# Altium schematic sheet Sintetizador2.SchDoc
size A4; SheetNumber: 12; SheetTotal: 13
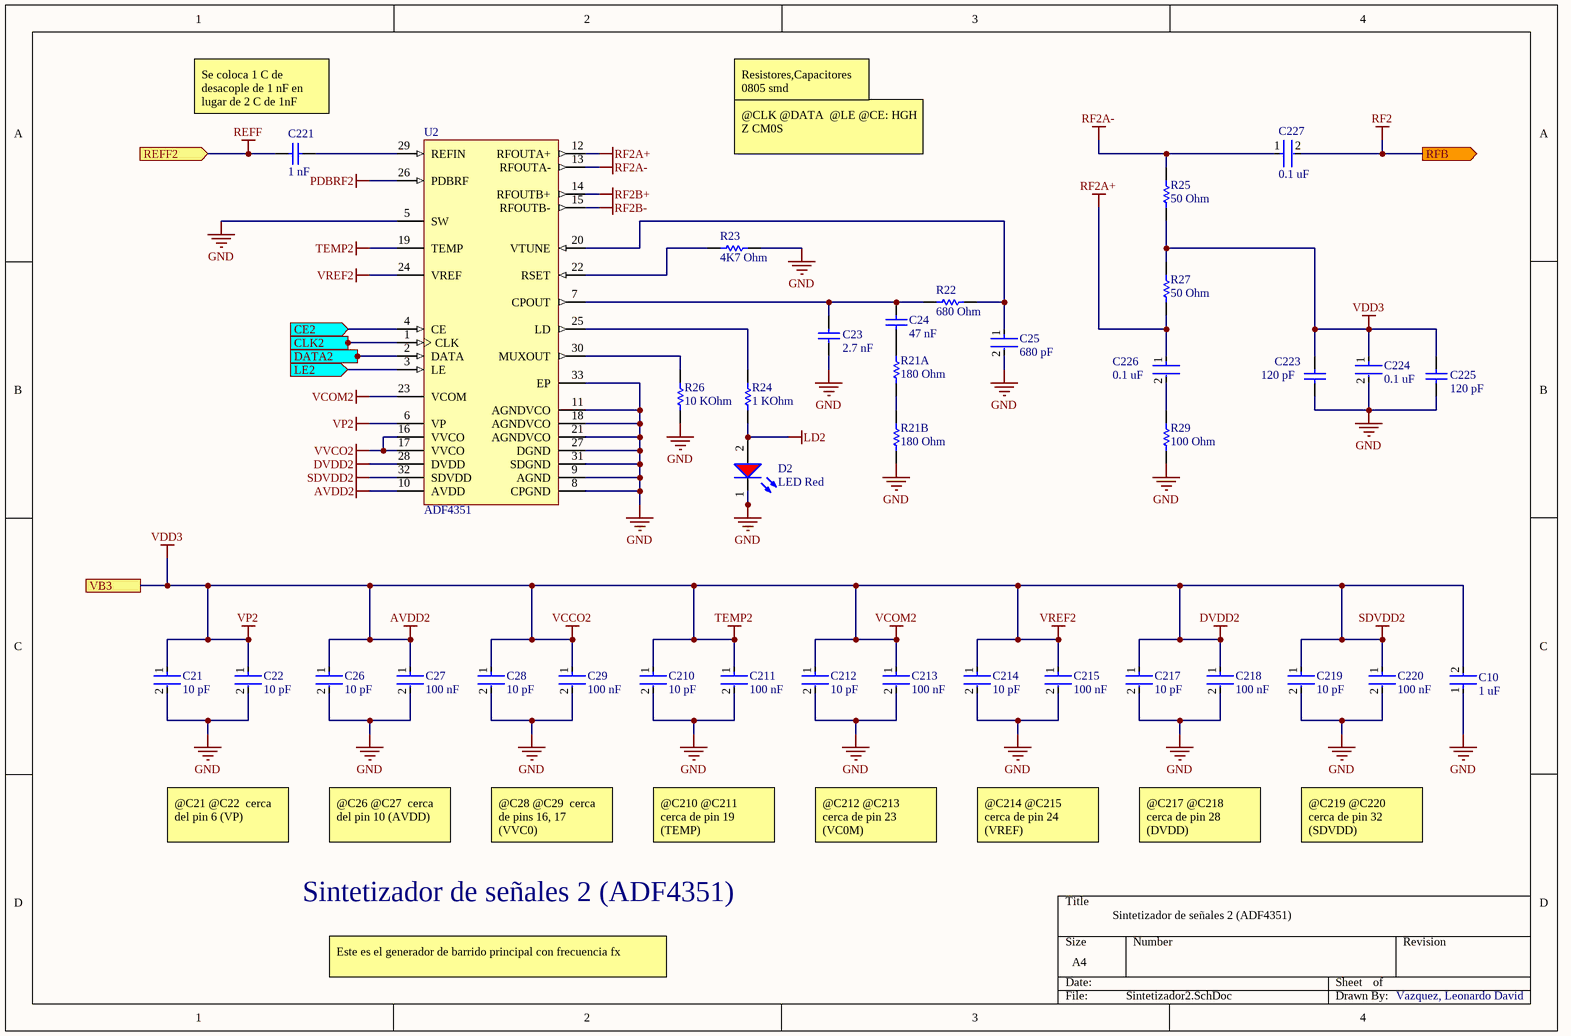
[diagram p0: Sintetizador2.SchDoc]

## Parts
C10  1 uF  [FP-CC0805-0_85-MFG]
C21  10 pF  [FP-CL21-IPC_C]
C22  10 pF  [FP-CL21-IPC_C]
C23  2.7 nF  [CAPC2013X130X50NL20T20]
C24  47 nF  [CAPC2013X100X50ML20T25]
C25  680 pF  [FP-C0805C-DN-MFG]
C26  10 pF  [FP-CL21-IPC_C]
C27  100 nF  [FP-CL21-IPC_C]
C28  10 pF  [FP-CL21-IPC_C]
C29  100 nF  [FP-CL21-IPC_C]
C210  10 pF  [FP-CL21-IPC_C]
C211  100 nF  [FP-CL21-IPC_C]
C212  10 pF  [FP-CL21-IPC_C]
C213  100 nF  [FP-CL21-IPC_C]
C214  10 pF  [FP-CL21-IPC_C]
C215  100 nF  [FP-CL21-IPC_C]
C217  10 pF  [FP-CL21-IPC_C]
C218  100 nF  [FP-CL21-IPC_C]
C219  10 pF  [FP-CL21-IPC_C]
C220  100 nF  [FP-CL21-IPC_C]
C221  1 nF  [CAPC2013X94X50NL20T25]
C223  120 pF  [FP-CC0805-0_85-MFG]
C224  0.1 uF  [FP-CC0805-0_85-MFG]
C225  120 pF  [FP-CC0805-0_85-MFG]
C226  0.1 uF  [FP-CC0805-0_85-MFG]
C227  0.1 uF  [FP-CC0805-0_85-MFG]
D2  LED Red  [WL-SMCW_0805_150080xx75000]
R21A  180 Ohm  [RESC2013X70X40ML20T20]
R21B  180 Ohm  [RESC2013X70X40ML20T20]
R22  680 Ohm  [RESC2013X70X40ML20T20]
R23  4K7 Ohm  [RESC2013X70X40ML20T20]
R24  1 KOhm  [RESC2013X60X40ML20T25]
R25  50 Ohm  [RESC2013X60X40ML20T25]
R26  10 KOhm  [RESC2013X60X40ML20T25]
R27  50 Ohm  [RESC2013X60X40ML20T25]
R29  100 Ohm  [RESC2013X60X40ML20T25]
U2  ADF4351  [ADI-CP-32-2_L]

## Ports
CE2 (in, see ADF4351_10X2_v1[3C], Data_converter[4A]), CLK2 (in, see ADF4351_10X2_v1[3C], Data_converter[4B]), DATA2 (in, see ADF4351_10X2_v1[3C], Data_converter[4B]), LE2 (in, see ADF4351_10X2_v1[3C], Data_converter[4C]), REFF2 (in, see ADF4351_10X2_v1[3B]), RFB (out, see ADF4351_10X2_v1[3B]), VB3 (see ADF4351_10X2_v1[3B])

## Nets
AVDD2: C10.2 C21.1 C22.1 C26.1 C27.1 C28.1 C29.1 C210.1 C211.1 C212.1 C213.1 C214.1 C215.1 C217.1 C218.1 C219.1 C220.1 C223.1 C224.1 C225.1 R25.2 R27.1 U2.6(VP) U2.10(AVDD) U2.19(TEMP) U2.23(VCOM) U2.24(VREF) U2.28(DVDD) U2.32(SDVDD) ; port VB3  [also labelled DVDD2, SDVDD2, TEMP2, VCCO2, VCOM2, VDD3, VP2, VREF2]
GND: C10.1 C21.2 C22.2 C23.1 C25.2 C26.2 C27.2 C28.2 C29.2 C210.2 C211.2 C212.2 C213.2 C214.2 C215.2 C217.2 C218.2 C219.2 C220.2 C223.2 C224.2 C225.2 D2.1(K) R21B.1 R23.2 R26.2 R29.2 U2.5(SW) U2.8(CPGND) U2.9(AGND) U2.11(AGNDVCO) U2.18(AGNDVCO) U2.21(AGNDVCO) U2.27(DGND) U2.31(SDGND) U2.33(EP)
LD2: D2.2(A) R24.1
PDBRF2: U2.26(PDBRF)
REFF: C221.1 ; port REFF2
RF2: C227.2 ; port RFB
RF2A+: C226.1 R27.2 U2.12(RFOUTA+)
RF2A-: C227.1 R25.1 U2.13(RFOUTA-)
RF2B+: U2.14(RFOUTB+)
RF2B-: U2.15(RFOUTB-)
VVCO2: U2.16(VVCO) U2.17(VVCO)
CE2: U2.4(CE) ; port CE2
CLK2: U2.1(CLK) ; port CLK2
DATA2: U2.2(DATA) ; port DATA2
LE2: U2.3(LE) ; port LE2
NetC23_2: C23.2 C24.2 R22.1 U2.7(CPOUT)
NetC24_1: C24.1 R21A.2
NetC25_1: C25.1 R22.2 U2.20(VTUNE)
NetC221_2: C221.2 U2.29(REFIN)
NetC226_2: C226.2 R29.1
NetR21A_2: R21A.2 R21B.1
NetR23_1: R23.1 U2.22(RSET)
NetR24_2: R24.2 U2.25(LD)
NetR26_1: R26.1 U2.30(MUXOUT)

## Notes on the sheet
- (near C221) Se coloca 1 C de desacople de 1 nF en lugar de 2 C de 1nF
- Resistores,Capacitores 0805 smd
  2N3904 SOT-23
- @CLK @DATA  @LE @CE: HGH Z CM0S
- @C21 @C22  cerca del pin 6 (VP)
- @C26 @C27  cerca del pin 10 (AVDD)
- @C28 @C29  cerca de pins 16, 17 (VVC0)
- @C210 @C211  cerca de pin 19 (TEMP)
- @C212 @C213  cerca de pin 23 (VC0M)
- @C214 @C215  cerca de pin 24 (VREF)
- @C217 @C218  cerca de pin 28 (DVDD)
- @C219 @C220  cerca de pin 32 (SDVDD)
- Sintetizador de señales 2 (ADF4351)
- Este es el generador de barrido principal con frecuencia fx
- Vazquez, Leonardo David

## Library data of the parts
C10 C22 C224 C226 C227 = CMP-2100-03606-3: CAP CER 0.1UF 50V X7R 0805; Manufacturer Part Number: CC0805KRX7R9BB104; Manufacturer: Yageo; Tolerance: 0.1; Capacitance: 100 nF; Value: 100 nF; Material: Ceramic; Device Class L1: Passive Components; ComponentLink2Description: Datasheet; Package: CC0805-0.85; Digikey Description: CAP CER 0.1UF 50V X7R 0805; Device Class L3: Ceramic Capacitors; Temperature: -30°C to +85°C; Temperature Characteristic: X7R; Voltage Rating: 50 V; Height: 0.95mm; RoHS: TRUE; Ipc Land Pattern Name: CAPC200125X85; Device Class L2: Capacitors; Category: Cap; Temperature Range Low: -30°C; Temperature Range High: +85°C; Mouser Description: Multilayer Ceramic Capacitors MLCC - SMD/SMT 100nF 50V X7R 10%; Footprint Url: http://www.yageo.com/exep/pages/download/literatures/UPY-C_GEN_24.pdf; Automotive: No; Octopart: https://octopart.com/cc0805krx7r9bb104-yageo-192993; Lead Free: Yes; ComponentLink2URL: http://www.yageo.com/documents/recent/UPY-GPHC_Y5V_6.3V-to-50V_8.pdf
C21 C26 C28 C210 C212 C214 C217 C219 = CMP-13271-003234-1: CL21 Series 0805 10pF 100V ±0.25pF Tolerance C0G Multilayer Ceramic Chip Capacitor; Temperature Coefficient: 300ppm/°C; Length: 2mm; Packaging: Tape and Reel; Width: 0.049inch; Thickness: 0.03inch; Depth: 1.25mm; Case Code (Imperial): 0805; Package Quantity: 1; Capacitance: 10pF; Voltage: 100V; Case Code (Metric): 2012; Dielectric: C0G; Voltage Rating: 100V; Case/Package: 0805; Height: 0.65mm; Mount: Surface Mount; Radiation Hardening: No; Max Operating Temperature: 125°C; Voltage Rating (DC): 100V; Min Operating Temperature: -55°C; Material: Ceramic
C23 = CMP-2007-03635-1: Part Number: CDR31BX272BKMSAJ; Manufacturer: Vitramon
C24 = CMP-2007-03713-1: Manufacturer: Kemet; Part Number: C0805F473K5RACTU
C25 = CMP-1036-02839-3: CAP CER 680PF 100V 5% NP0 0805; Manufacturer: KEMET; Manufacturer Part Number: C0805C681J1GACTU; Temperature Coefficient: 30ppm/°C; Temperature Characteristic: C0G; Material: Ceramic; Tolerance: 0.05; Voltage Rating: 100 V; Category: Cap; Package: C0805C-DN; Ipc Land Pattern Name: CAPC200125X78; Automotive: No; Device Class L3: Ceramic Capacitors; Digikey Description: CAP CER 680PF 100V 5% NP0 0805; ComponentLink2Description: Datasheet; Lead Free: Yes; Temperature: -55°C to +125°C; Device Class L2: Capacitors; Value: 680 pF; ComponentLink2URL: https://content.kemet.com/datasheets/KEM_C1003_C0G_SMD.pdf; Device Class L1: Passive Components; Mouser Description: Cap Ceramic 680pF 100V C0G 5% SMD 0805 125°C Plastic T/R; Octopart: https://octopart.com/c0805c681j1gactu-kemet-8375796; Temperature Range High: +125°C; RoHS: TRUE; Height: 0.88mm; Temperature Range Low: -55°C; Capacitance: 680 pF
C27 C29 C211 C213 C215 C218 C220 = CMP-2100-03606-3: CAP CER 0.1UF 50V X7R 0805; Manufacturer Part Number: CC0805KRX7R9BB104; Manufacturer: Yageo; Tolerance: 0.1; Material: Ceramic; Device Class L1: Passive Components; ComponentLink2Description: Datasheet; Package: CC0805-0.85; Digikey Description: CAP CER 0.1UF 50V X7R 0805; Capacitance: 100 nF; Device Class L3: Ceramic Capacitors; Value: 100 nF; Temperature: -30°C to +85°C; Temperature Characteristic: X7R; Voltage Rating: 50 V; Height: 0.95mm; RoHS: TRUE; Ipc Land Pattern Name: CAPC200125X85; Device Class L2: Capacitors; Category: Cap; Temperature Range Low: -30°C; Temperature Range High: +85°C; Mouser Description: Multilayer Ceramic Capacitors MLCC - SMD/SMT 100nF 50V X7R 10%; Footprint Url: http://www.yageo.com/exep/pages/download/literatures/UPY-C_GEN_24.pdf; Automotive: No; Octopart: https://octopart.com/cc0805krx7r9bb104-yageo-192993; Lead Free: Yes; ComponentLink2URL: http://www.yageo.com/documents/recent/UPY-GPHC_Y5V_6.3V-to-50V_8.pdf
C221 = CMP-2007-04125-1: Manufacturer: AVX Interconnect / Elco; Part Number: 08051A102J4T2A
C223 C225 = CMP-2007-00459-1: Manufacturer: Kemet; Part Number: C0805C101JCGACTU
D2 = CMP-1426-00011-2: NexarPartId: 29717781; Peak Wavelength: 630nm; Wavelength: 625nm; Viewing Angle: 140°; Test Current: 20mA; Forward Voltage: 2V; Forward Current: 100mA; Lens Style: Clear, Rectangular; Luminous Intensity: 150mcd; Max Reverse Voltage (DC): 5V; Length: 2mm; Case Code (Imperial): 0805; RoHS: Compliant; Max Operating Temperature: 85°C; Height: 700µm; Packaging: Tape and Reel; Color: Red; Case/Package: 0805; REACH SVHC: Unknown; Dominant Wavelength: 625nm; Min Operating Temperature: -40°C; Case Code (Metric): 2012; Mount: Surface Mount; Width: 1.25mm
R21A R21B = CMP-2001-00537-1: Manufacturer: Panasonic; Part Number: ERJ-6ENF3600V
R22 R23 = CMP-2001-00569-1: Part Number: ERJ6ENF6803V; Manufacturer: Panasonic
R24-R27 R29 = CMP-2001-00580-1: Manufacturer: Panasonic; Part Number: ERA6AEB101V
U2 = CMP-0287-00015-1: Wideband Synthesizer with Integrated VCO, CP-32-2, Pb-Free, 1500 Reel; Max RF Input (MHz): 4.4GHz; RF Prescalers: 4/5,8/9; Max REFin (MHz): 250MHz; Frequency Range: 35MHz-4.4GHz; Norm Phase Noise (dBc/Hz): -221dBc; Supply Current: 110mA; Single/Dual: Single; PackageVersion: Jan-2005; ComponentLink3URL: http://www.analog.com/static/imported-files/packages/414143737956480539664569CP_32_2.pdf; PackageReference: CP-32-2; ComponentLink2URL: http://www.analog.com/static/imported-files/data_sheets/ADF4351.pdf; ComponentLink1URL: www.analog.com; ComponentLink1Description: Manufacturer URL; ComponentLink2Description: Datasheet; ComponentLink3Description: Package Specification; PackageDescription: 32-Lead Lead Frame Chip Scale Package [LFCSP_VQ]; DatasheetVersion: Rev. Pr D; Code_JEDEC: MO-220-VHHD-2